# EAGLE design amp_nanopi (EAGLE 6.6.0)
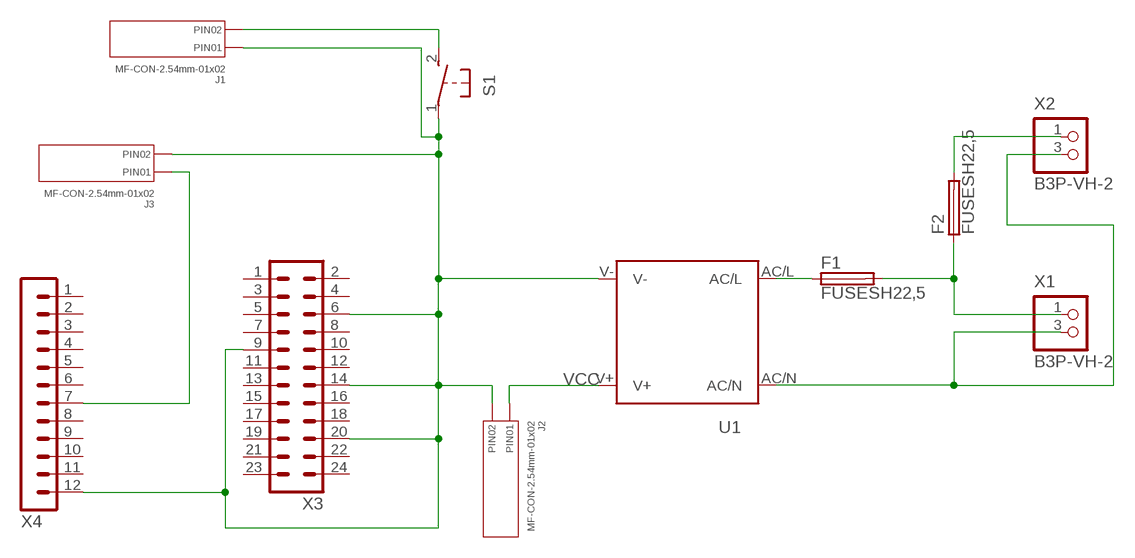
[diagram p0: schematic, sheet 1]

## Parts
F1  FUSESH22,5  [SH22,5]
F2  FUSESH22,5  [SH22,5]
J1  MF-CON-2.54mm-01x02  CON_01X02_PTH_2.54MM  [PTH_2.54MM_01X02]
J2  MF-CON-2.54mm-01x02  CON_01X02_PTH_2.54MM  [PTH_2.54MM_01X02]
J3  MF-CON-2.54mm-01x02  CON_01X02_PTH_2.54MM  [PTH_2.54MM_01X02]
S1  31-XX  [B3F-31XX]
U1  IRM_05/10  [IRM_05/10]
X1  B3P-VH-2  [B3P-VH-2]
X2  B3P-VH-2  [B3P-VH-2]
X3  MA12-2  [MA12-2]
X4  MA12-1  [MA12-1]

## Nets
GND: J1.P$1(PIN1) J2.P$2(PIN2) J3.P$2(PIN2) S1.1(P) U1.V- X3.6 X3.9 X3.14 X3.20 X4.12
N$1: J3.P$1(PIN1) X4.7
N$2 [230V]: F2.2 X2.1
N$4 [230V]: F1.2 F2.1 X1.1
N$5 [230V]: F1.1 U1.AC/L
N$6 [230V]: U1.AC/N X1.3 X2.3
PWR: J1.P$2(PIN2) S1.2(S)
VCC: J2.P$1(PIN1) U1.V+
Unconnected: X3.1 X3.2 X3.3 X3.4 X3.5 X3.7 X3.8 X3.10 X3.11 X3.12 X3.13 X3.15 X3.16 X3.17 X3.18 X3.19 X3.21 X3.22 X3.23 X3.24 X4.1 X4.2 X4.3 X4.4 X4.5 X4.6 X4.8 X4.9 X4.10 X4.11

## Library data of the parts
F1 F2 = fuse:FUSE: Fuse; OC_FARNELL: unknown; OC_NEWARK: unknown
J1-J3 = MF_Connectors:CON_01X02: Library: MF_Connectors Description: Header Connector with 02 Positions and 01 Rows. Use the LABEL Attribute to label the pin on the schematic and PCB. You can remove the attributes on the PCB by using the SMASH function on the part and then deleting the text.; HOUSEPART: YES; MPN: MF-CON-2.54mm-01x02; POPULATE: 1; URL: https://factory.macrofab.com/part/MF-CON-2.54mm-01x02
S1 = switch-omron:31-XX: OMRON SWITCH; MPN: B3F-3100; OC_FARNELL: 959704; OC_NEWARK: 36M3582
U1 = meanwell_irm_v5:IRM_05/10: 5 or 10 watt housing & pin compatible IRM 05 Vout [V] Imax [A] Pmax [W] Eff [%] 3.3 1.25 4.125 68 5 1 5 71 12 0.42 5.04 75 15 0.33 4.95 75 24 0.23 5.52 77 IRM 10 Vout [V] Imax [A] Pmax [W] Eff [%] 3.3 2.5 8.25 74 5 2 10 77 12 0.85 10.2 82 15 0.67 10.05 82 24 0.42 10.08 82
X1 X2 = jst-vh:B3P-VH-2
X3 = con-lstb:MA12-2: PIN HEADER; OC_FARNELL: unknown; OC_NEWARK: unknown
X4 = con-lstb:MA12-1: PIN HEADER; OC_FARNELL: unknown; OC_NEWARK: unknown

## Net classes
0 default: width 0.762 mm, drill 0.762 mm, clearance 0.762 mm
1 230V: width 2.032 mm, drill 1.27 mm, clearance 5.08 mm

## Board
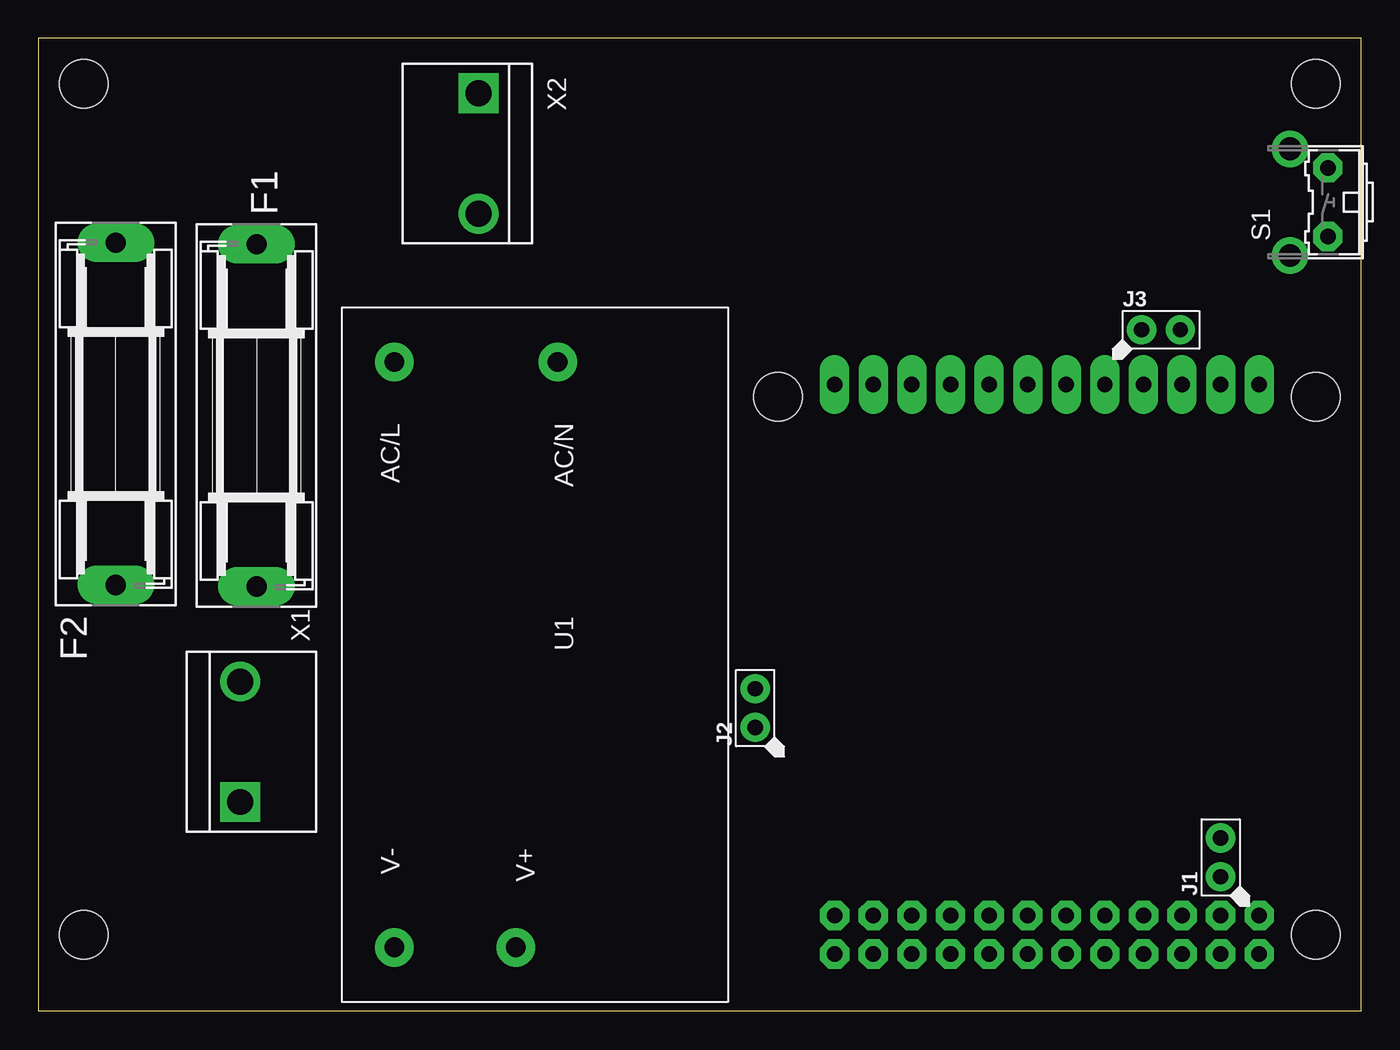
[diagram p1: board, top side]
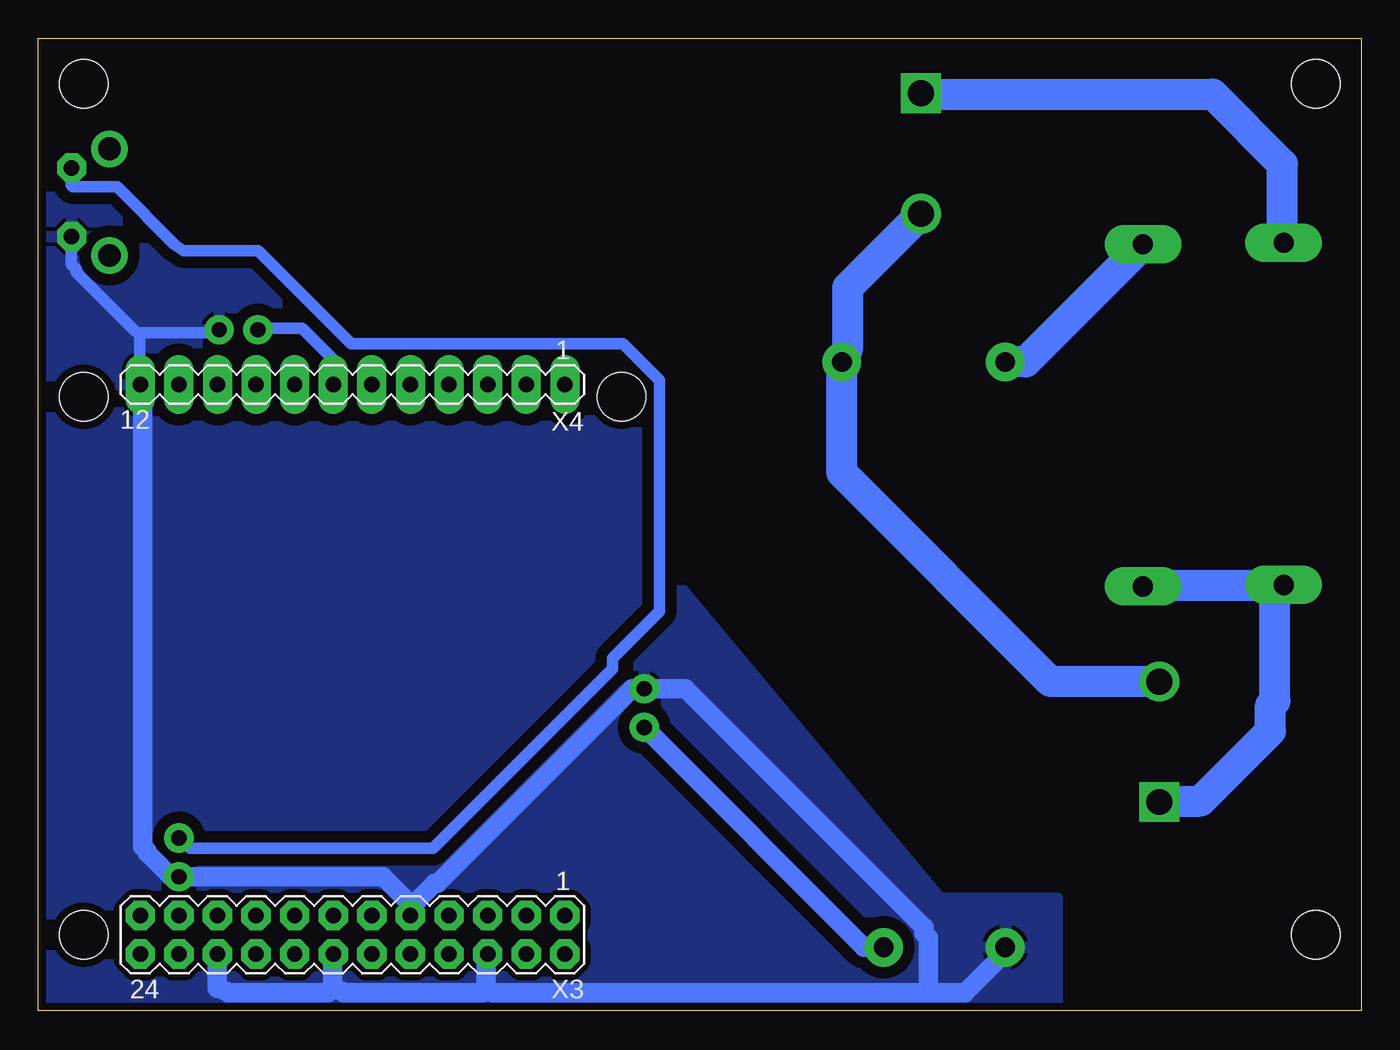
[diagram p2: board, bottom side, seen from below]

Size 87.1 x 64 mm. Coordinates in mm from the lower left corner, seen from the top.
Outline: 0,0 87.1,0 87.1,64 0,64 0,0
Copper layers (1*16): Top 0.035mm / dielectric 1.5mm / Bottom 0.035mm
Design rules "default *": minimum track width 10mil, minimum drill 10mil, track to track 12mil, track to pad 12mil, pad to pad 12mil, via to via 12mil, smd to smd 12mil, copper to edge 20mil, drill to drill 12mil, minimum pad ring 18mil, minimum via ring 8mil, stop-mask expansion 4mil, vias tented up to drill 0mil, thermal gap 10mil
Holes 3.2 mm at 3,5 3,61 84.1,5 84.1,61 84.1,40.4 48.7,40.4

### Footprints (pad centres in the part's own frame; a part is rotated, then mirrored left to right if it is on the bottom)
SH22,5 = drill 1.321 pad 2.54 long: 1 -11.252,0; 2 11.252,0
PTH_2.54MM_01X02 = drill 1: P$1 -1.27,0; P$2 1.27,0
B3F-31XX = drill 1.016 octagon: 1 -2.261,-1.245; 2 2.261,-1.245 | drill 1.499 pad 2.159: 3 -3.505,1.245; 4 3.505,1.245
IRM_05/10 = drill 1.3 pad 2.54: AC/L -19.25,-9.25; AC/N -19.25,1.5; V+ 19.25,-1.25; V- 19.25,-9.25
B3P-VH-2 = drill 1.7 square: 1 -3.96,0 | drill 1.7: 3 3.96,0
MA12-2 = drill 1.016 octagon: 1 -13.97,-1.27; 2 -13.97,1.27; 3 -11.43,-1.27; 4 -11.43,1.27; 5 -8.89,-1.27; 6 -8.89,1.27; 7 -6.35,-1.27; 8 -6.35,1.27; 9 -3.81,-1.27; 10 -3.81,1.27; 11 -1.27,-1.27; 12 -1.27,1.27; 13 1.27,-1.27; 14 1.27,1.27; 15 3.81,-1.27; 16 3.81,1.27; 17 6.35,-1.27; 18 6.35,1.27; 19 8.89,-1.27; 20 8.89,1.27; 21 11.43,-1.27; 22 11.43,1.27; 23 13.97,-1.27; 24 13.97,1.27
MA12-1 = drill 1.016 long: 1 -13.97,0; 2 -11.43,0; 3 -8.89,0; 4 -6.35,0; 5 -3.81,0; 6 -1.27,0; 7 1.27,0; 8 3.81,0; 9 6.35,0; 10 8.89,0; 11 11.43,0; 12 13.97,0

### Placement (x,y rotation side)
F1  14.38,39.17 270 top
F2  5.12,39.27 90 top
J1  77.83,10.1 90 top
J2  47.2,19.91 90 top
J3  73.9,44.8 0 top
S1  83.64,53.2 90 top
U1  32.7,23.43 270 top
X1  13.3,17.7 90 top
X2  29,56.4 270 top
X3  66.4,5 180 bottom
X4  66.4,41.2 180 bottom

### Tracks (layer width: path | path; a pad name or v marks a point on that pad's centre or on a via)
GND
  Bottom 0.762: 80.4,44.6 80.4,41.8 X4.12 | J3.P$2 75.37,44.6 80.4,44.6 | S1.1 84.9,50.9 84.9,49.1 84.6,48.8 84.6,48.6 80.7,44.7 80.4,44.6
  Bottom 1.27: 23.5,4.2 U1.V- 23.7,3.6 26.1,1.2 28.5,1.2 | X3.9 62.59,6.91 62.53,6.96 | X3.20 75.3,3.7 75.3,1.5 74.7,1.3 74.6,1.2 68,1.2 67.7,1.5 | 67.7,1.5 67.7,3.7 X3.14 | 57.6,1.6 57.6,3.7 X3.6 | 57.6,1.6 57.6,1.4 57.8,1.2 67,1.2 67.1,1.3 67.7,1.5 | 28.5,1.2 57.2,1.2 57.6,1.6 | 28.5,1.2 28.5,4.8 28.8,5.1 28.8,5.5 44.48,21.18 J2.P$2 48.02,21.18 60.8,8.4 61,8.4 62.1,7.3 62.53,6.96 | 62.53,6.96 64.4,8.83 J1.P$1 78.4,8.9 79.9,10.4 79.9,10.5 80.2,10.8 80.2,40.9 X4.12
  pour Bottom: 87.1,0 87.1,64 67,64 45.3,42.3 45.4,28.6 27.7,7.4 20,7.4 20,0
N$1
  Bottom 0.762: X4.7 67.7,41.2 67.7,42.9 69.7,44.9 72.53,44.9 J3.P$1
N$2
  Bottom 2.032: F2.2 5.2,50.6 5.2,55.7 9.8,60.3 29,60.3 X2.1
N$4
  Bottom 2.032: F1.2 13.4,28 5.2,28 F2.1 5.7,27 5.7,20.4 6,20.1 6,18.4 10.6,13.8 13.3,13.8 X1.1
N$5
  Bottom 2.032: U1.AC/L 23.4,42.7 22.1,42.7 14.4,50.4 F1.1
N$6
  Bottom 2.032: X2.3 29,52.4 33.8,47.6 33.8,43.6 U1.AC/N 34.2,35.4 20.46,21.66 X1.3
PWR
  Bottom 0.762: S1.2 84.9,55.4 84.9,54.3 84.8,54.2 81.9,54.2 78.1,50.4 77.5,50 72.6,50 66.5,43.9 48.6,43.9 46.2,41.5 46.2,26.3 49.3,23.2 49.3,22.5 61.1,10.7 77.1,10.7 77.8,11.4 J1.P$2
VCC
  Bottom 1.27: U1.V+ 32.73,4.18 J2.P$1